# EasyEDA Pro project ProPrj_觉之瞳 ESP32_2025-01-02.epro

# Schematic Schematic1
Board Name: Board1; Create Date: 2024-11-07; Page Name: P1; Project Name: 觉之瞳 ESP32; Schematic Name: Schematic1; Update Date: 2024-12-07; Company: 嘉立创EDA; Page Size: A4; Version: V1.0
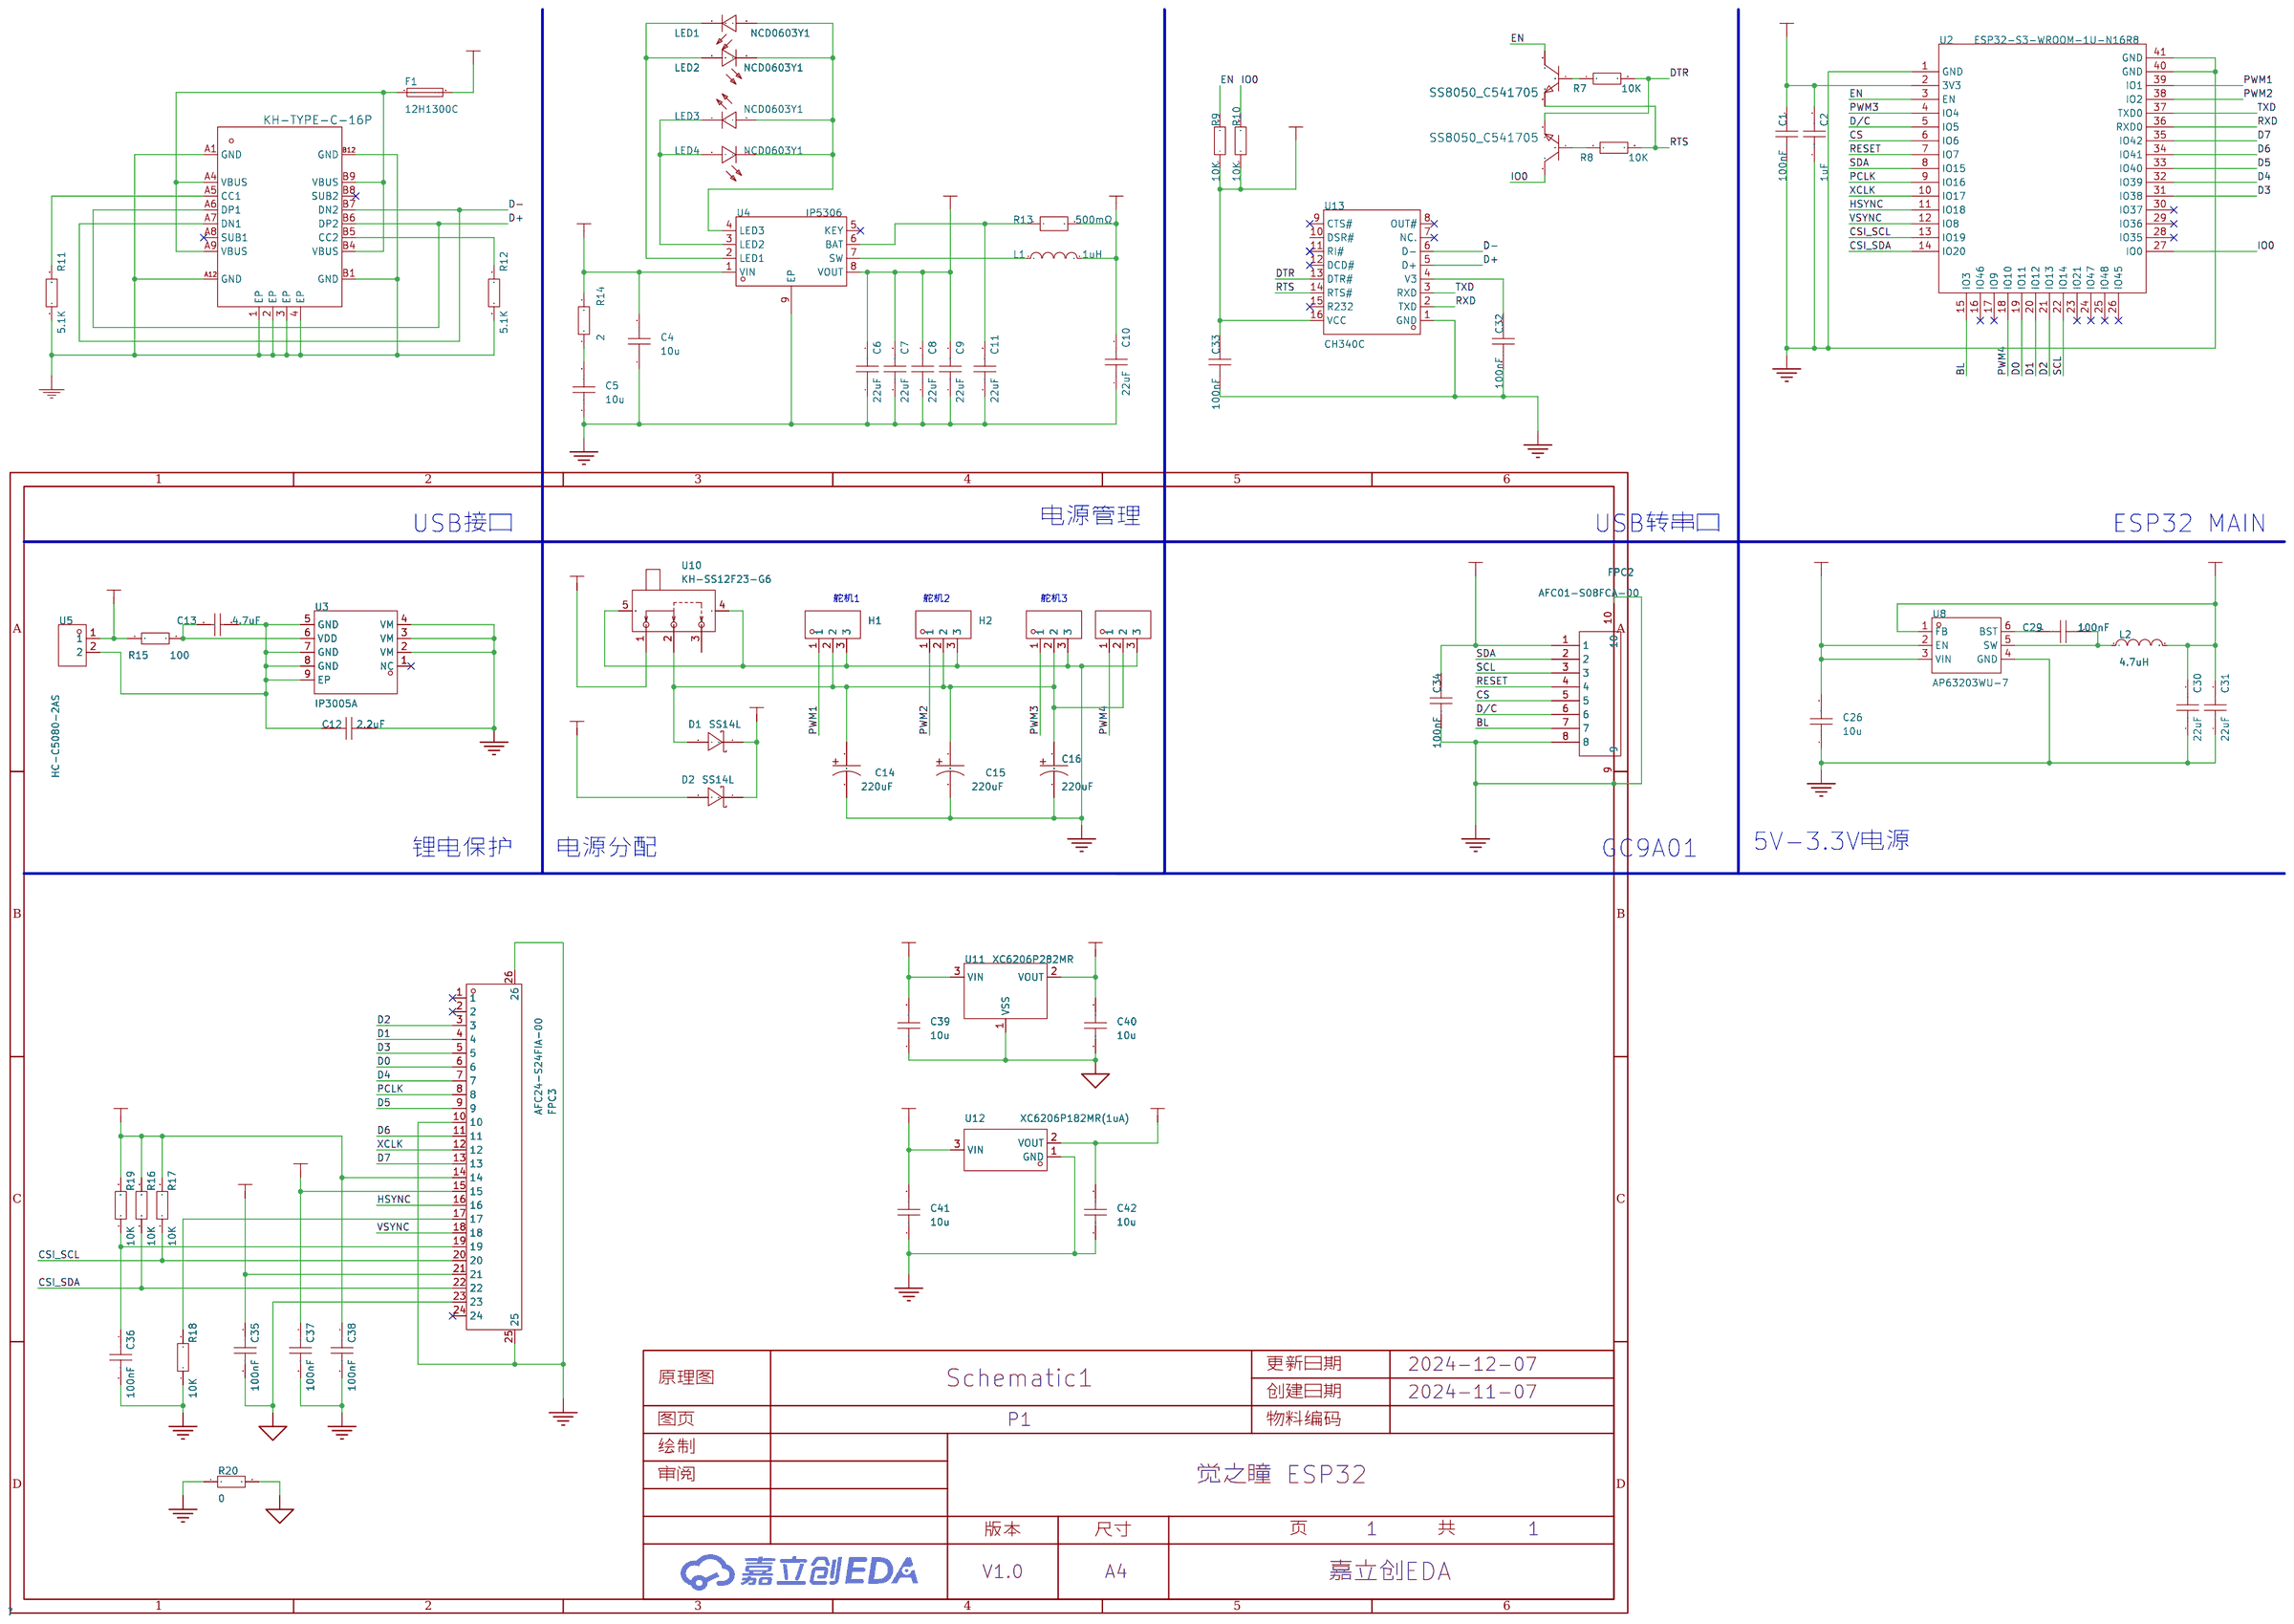
[diagram p0: schematic sheet]

## Parts
C1  100nF  [C0603]
C2  1uF  [C0603]
C4  10u  [C0603]
C5  10u  [C0603]
C6  22uF  [C0805]
C7  22uF  [C0805]
C8  22uF  [C0805]
C9  22uF  [C0805]
C10  22uF  [C0805]
C11  22uF  [C0805]
C12  2.2uF  [C0603]
C13  4.7uF  [C0603]
C14  220uF  [CAP-SMD_BD6.3-L6.6-W6.6-FD-A]
C15  220uF  [CAP-SMD_BD6.3-L6.6-W6.6-FD-A]
C16  220uF  [CAP-SMD_BD6.3-L6.6-W6.6-FD-A]
C26  10u  [C0603]
C29  100nF  [C0603]
C30  22uF  [C0805]
C31  22uF  [C0805]
C32  100nF  [C0603]
C33  100nF  [C0603]
C34  100nF  [C0603]
C35  100nF  [C0603]
C36  100nF  [C0603]
C37  100nF  [C0603]
C38  100nF  [C0603]
C39  10u  [C0603]
C40  10u  [C0603]
C41  10u  [C0603]
C42  10u  [C0603]
D1  SS14L  [SOD-123F_L2.8-W1.8-LS3.7-RD]
D2  SS14L  [SOD-123F_L2.8-W1.8-LS3.7-RD]
F1  12H1300C  [F1206]
FPC2  AFC01-S08FCA-00  [FPC-SMD_P0.50-8P_FGS-XJ-H2.0]
FPC3  AFC24-S24FIA-00  [FPC-SMD_P0.50-24P_QCHF-SM-H2.0]
H1  -  [HDR-TH_3P-P2.54-V-M]
H2  -  [HDR-TH_3P-P2.54-V-M]
H3  -  [HDR-TH_3P-P2.54-V-M]
H4  -  [HDR-TH_3P-P2.54-V-M]
L1  1uH  [IND-SMD_L7.0-W6.6]
L2  4.7uH  [IND-SMD_L4.4-W4.2]
LED1  NCD0603Y1  [LED0603-RD]
LED2  NCD0603Y1  [LED0603-RD]
LED3  NCD0603Y1  [LED0603-RD]
LED4  NCD0603Y1  [LED0603-RD]
Q1  SS8050_C541705  [SOT-23-3_L2.9-W1.3-P1.90-LS2.4-BR]
Q2  SS8050_C541705  [SOT-23-3_L2.9-W1.3-P1.90-LS2.4-BR]
R7  10K  [R0603]
R8  10K  [R0603]
R9  10K  [R0603]
R10  10K  [R0603]
R11  5.1K  [R0603]
R12  5.1K  [R0603]
R13  500mΩ  [R0805]
R14  2  [R0603]
R15  100  [R0603]
R16  10K  [R0603]
R17  10K  [R0603]
R18  10K  [R0603]
R19  10K  [R0603]
R20  0  [R0603]
U2  ESP32-S3-WROOM-1U-N16R8  [WIRELM-SMD_ESP32-S3-WROOM-1U]
U3  IP3005A  [ESOP-8_L4.9-W3.9-P1.27-LS6.0-BL-EP]
U4  IP5306  [ESOP-8_L4.9-W3.9-P1.27-LS6.0-BL-EP]
U5  HC-C5080-2AS  [CONN-TH_HC-C5080-2AS]
U8  AP63203WU-7  [TSOT-26_L2.9-W1.6-P0.95-LS2.8-BL]
U10  KH-SS12F23-G6  [SW-TH_KH-SS12F23-G6]
U11  XC6206P282MR  [SOT-23-3_L2.9-W1.3-P0.95-LS2.4-BR]
U12  XC6206P182MR(1uA)  [SOT-23-3_L2.9-W1.6-P1.90-LS2.8-BR]
U13  CH340C  [SOP-16_L10.0-W3.9-P1.27-LS6.0-BL]
USB1  KH-TYPE-C-16P  [USB-C-SMD_KH-TYPE-C-16P]

## Library data of the parts
C1 C29 C32-C38 = CL10B104KB8NNNC: 容值:100nF;精度:±10%;额定电压:50V;材质(温度系数):X7R;; LCSC Part Name: 100nF ±10% 50V; Supplier Part: C1591; Manufacturer: SAMSUNG(三星); Supplier Footprint: 0603; JLCPCB Part Class: 扩展库; Datasheet: https://atta.szlcsc.com/upload/public/pdf/source/20160218/1457707763339.pdf; Supplier: LCSC; Tolerance: ±10%; Voltage Rated: 50V; Temperature Coefficient: X7R
C2 = CL10A105KB8NNNC: 容值:1uF;精度:±10%;额定电压:50V;材质(温度系数):X5R;; LCSC Part Name: 1uF ±10% 50V; Supplier Part: C15849; Manufacturer: SAMSUNG(三星); Supplier Footprint: 0603; JLCPCB Part Class: 基础库; Datasheet: https://atta.szlcsc.com/upload/public/pdf/source/20160218/1457707763339.pdf; Supplier: LCSC; Tolerance: ±10%; Voltage Rated: 50V; Temperature Coefficient: X5R
C4 C5 C26 C39-C42 = CAP_0603: Supplier Footprint: 0603
C6-C11 C30 C31 = CL21A226MAQNNNE: 容值:22uF;精度:±20%;额定电压:25V;材质(温度系数):X5R;; LCSC Part Name: 22uF ±20% 25V; Supplier Part: C45783; Manufacturer: SAMSUNG(三星); Supplier Footprint: 0805; JLCPCB Part Class: 基础库; Datasheet: https://atta.szlcsc.com/upload/public/pdf/source/20160218/1457707763339.pdf; Supplier: LCSC; Tolerance: ±20%; Voltage Rated: 25V; Temperature Coefficient: X5R
C12 = CL10A225KB8NNNC: 容值:2.2uF;精度:±10%;额定电压:50V;材质(温度系数):X5R;; LCSC Part Name: 2.2uF ±10% 50V; Supplier Part: C913904; Manufacturer: SAMSUNG(三星); Supplier Footprint: 0603; JLCPCB Part Class: 扩展库; Datasheet: https://atta.szlcsc.com/upload/public/pdf/source/20160218/1457707763339.pdf; Supplier: LCSC; Tolerance: ±10%; Voltage Rated: 50V; Temperature Coefficient: X5R
C13 = CL10A475KO8NNNC: 容值:4.7uF;精度:±10%;额定电压:16V;材质(温度系数):X5R;; LCSC Part Name: 4.7uF ±10% 16V; Supplier Part: C19666; Manufacturer: SAMSUNG(三星); Supplier Footprint: 0603; JLCPCB Part Class: 基础库; Datasheet: https://atta.szlcsc.com/upload/public/pdf/source/20160218/1457707763339.pdf; Supplier: LCSC; Tolerance: ±10%; Voltage Rated: 16V; Temperature Coefficient: X5R
C14-C16 = OVZ221M0JTR-0606: 容值:220uF;精度:±20%;额定电压:6.3V;纹波电流:3.16A@100kHz;等效串联电阻:15mΩ@100kHz~300kHz;类型:-;; LCSC Part Name: 220uF ±20% 6.3V; Supplier Part: C182403; Manufacturer: lelon(立隆); Supplier Footprint: SMD,D6.3xL5.9mm; JLCPCB Part Class: 扩展库; Datasheet: https://atta.szlcsc.com/upload/public/pdf/source/20180224/C182403_15194369721561364002.pdf; Supplier: LCSC; Tolerance: ±20%; Rated Voltage: 6.3V; Ripple Current: 3.16A@100kHz; Equivalent Series Resistance(ESR): 15mΩ@100kHz~300kHz; φD: 6.3mm; L: 5.9mm; Lifetime @ Temp: 2000hrs@105℃; Operating Temperature: -55℃~+105℃
D1 D2 = SS14L: 正向压降(Vf):550mV@1A;直流反向耐压(Vr):40V;平均整流电流(Io):1A;; LCSC Part Name: 电压:40V 电流:1A; Supplier Part: C190475; Manufacturer: Hottech(合科泰); Supplier Footprint: SOD-123FL; JLCPCB Part Class: 扩展库; Datasheet: https://atta.szlcsc.com/upload/public/pdf/source/20220428/72E7AB72DDDD17C14C2A3F6F251D8FA3.pdf; Supplier: LCSC; Forward Voltage (Vf@If): 550mV@1A; Reverse Voltage (Vr): 40V; Average Rectified Current (Io): 1A
F1 = 12H1300C: 类型:贴片式保险丝;额定电流:3A;额定电压 (DC):63V;分断能力:50A;; LCSC Part Name: 贴片式保险丝; Supplier Part: C182445; Manufacturer: LANSON(良胜); Supplier Footprint: 1206; JLCPCB Part Class: 扩展库; Datasheet: https://atta.szlcsc.com/upload/public/pdf/source/20180301/C182975_15198945731771384144.pdf; Supplier: LCSC; Type: 贴片式保险丝; Current Rating: 3A; Voltage Rating (DC): 63V; Operating Temperature: -55℃~+125℃; Breaking Capacity: 50A
FPC2 = AFC01-S08FCA-00: 锁定特性:翻盖式;触点类型:下接;触点数量:8P;间距:0.5mm;安装类型:卧贴;; LCSC Part Name: 间距:0.5mm P数:8P 翻盖式 下接; Supplier Part: C262657; Manufacturer: JS(钜硕电子); Supplier Footprint: SMD,P=0.5mm,卧贴; JLCPCB Part Class: 扩展库; Datasheet: https://atta.szlcsc.com/upload/public/pdf/source/20190816/C413942_2A72D1AC756EAE17EEDF756A339D4500.pdf; Supplier: LCSC; Locking Feature: 翻盖式; Contact Type: 下接; Number of Contacts: 8P; Pitch: 0.5mm; Mounting Type: 卧贴; FFC, FCB Thickness: 0.3mm; Height Above Board: 2mm
FPC3 = AFC24-S24FIA-00: 锁定特性:翻盖式;触点类型:双侧触点/上下接;触点数量:24P;间距:0.5mm;安装类型:卧贴;; LCSC Part Name: 间距:0.5mm P数:24P 翻盖式 双侧触点/上下接; Supplier Part: C262683; Manufacturer: JS(钜硕电子); Supplier Footprint: SMD,P=0.5mm,卧贴; JLCPCB Part Class: 扩展库; Datasheet: https://atta.szlcsc.com/upload/public/pdf/source/20180814/C262679_7FB2CAD07E71B2E22E52A118EE33337B.pdf; Supplier: LCSC; Locking Feature: 翻盖式; Contact Type: 双侧触点/上下接; Number of Contacts: 24P; Pitch: 0.5mm; Mounting Type: 卧贴; FFC, FCB Thickness: 0.3mm; Height Above Board: 2mm
H1-H4 = HDR-M_2.54_1x3P: Supplier Part: C2937625; Supplier Footprint: 插件; JLCPCB Part Class: 扩展库
L1 = FXL0630-1R0-M: 电感值:1uH;精度:±20%;额定电流:12A;饱和电流(Isat):15A;类型:一体成型电感;; LCSC Part Name: 1uH ±20% 15A; Supplier Part: C167216; Manufacturer: cjiang(长江微电); Supplier Footprint: SMD,6.6x7mm; JLCPCB Part Class: 扩展库; Datasheet: https://atta.szlcsc.com/upload/public/pdf/source/20240426/3189EA8206330E2108542F9E34E540E7.pdf; Supplier: LCSC; Tolerance: ±20%; Rated Current: 12A; Saturation Current (Isat): 15A; DC Resistance (DCR): 7.4mΩ; Type: 一体成型电感
L2 = FXL0420-4R7-M: 电感值:4.7uH;精度:±20%;额定电流:2.8A;饱和电流(Isat):3A;类型:一体成型电感;; LCSC Part Name: 4.7uH ±20% 3A; Supplier Part: C167208; Manufacturer: cjiang(长江微电); Supplier Footprint: SMD,4.2x4.4mm; JLCPCB Part Class: 扩展库; Datasheet: https://atta.szlcsc.com/upload/public/pdf/source/20240426/3189EA8206330E2108542F9E34E540E7.pdf; Supplier: LCSC; Tolerance: ±20%; Rated Current: 2.8A; Saturation Current (Isat): 3A; DC Resistance (DCR): 105mΩ; Type: 一体成型电感
LED1-LED4 = NCD0603Y1: 发光颜色:黄色;正向电压(VF):1.6V~2.6V;功率:65mW;正向电流:20mA;主波长:586nm~595nm;透镜颜色:无色透明透镜;发光强度:80mcd~220mcd;发光角度:130°;工作温度:-30℃~+85℃;; Supplier Part: C84268; Manufacturer: 国星光电; Supplier Footprint: 0603; JLCPCB Part Class: 扩展库; Datasheet: https://atta.szlcsc.com/upload/public/pdf/source/20200820/C84268_8FC106CB292CF978F9CFC6892464F83C.pdf; Supplier: LCSC; Emitted Color: 黄色; Forward Voltage (VF): 1.6V~2.6V; Power Dissipation: 65mW; Forward Current: 20mA; Dominant Wavelength: 586nm~595nm; Lens Color: 无色透明透镜; Luminous Intensity: 80mcd~220mcd; Viewing Angle: 130°; Operating Temperature: -30℃~+85℃
Q1 = SS8050_C541705_SOT-23-3_L2.9-W1.3-P1.90-LS2.4-BR: Supplier: LCSC; Supplier Part: C541705; Manufacturer: AnBon; Manufacturer Part: SS8050; JLCPCB Part Class: Extended Part
Q2 = SS8050_C541705: Supplier: LCSC; Supplier Part: C541705; Manufacturer: AnBon; Manufacturer Part: SS8050; JLCPCB Part Class: Extended Part
R7-R12 R14-R20 = Res_0603: Supplier Footprint: 0603
R13 = FRL0805JR500TS: 电阻类型:厚膜电阻;阻值:500mΩ;精度:±5%;功率:125mW;最大工作电压:300V;温度系数:±300ppm/℃;; LCSC Part Name: 500mΩ ±5% 125mW 厚膜电阻; Supplier Part: C2934281; Manufacturer: FOJAN(富捷); Supplier Footprint: 0805; JLCPCB Part Class: 扩展库; Datasheet: https://atta.szlcsc.com/upload/public/pdf/source/20211221/925EC7D7225764EE0046F22065062C87.pdf; Supplier: LCSC; Type: 厚膜电阻; Tolerance: ±5%; Power(Watts): 125mW; Overload Voltage (Max): 300V; Temperature Coefficient: ±300ppm/℃; Operating Temperature Range: -55℃~+155℃
U2 = ESP32-S3-WROOM-1U-N16R8: Supplier Part: C3013946; Manufacturer: ESPRESSIF(乐鑫); Supplier Footprint: SMD,18x19.2mm; JLCPCB Part Class: 扩展库; Datasheet: https://atta.szlcsc.com/upload/public/pdf/source/20240130/9D71F4DF55874C504AB629FEEE3F038E.pdf; Supplier: LCSC
U3 = IP3005A: 过充电压:4.28V,过充恢复电压:4.1V,高精度内置MOSFET单节锂电池保护IC; Supplier Part: C181685; Manufacturer: INJOINIC(英集芯); Supplier Footprint: ESOP-8; JLCPCB Part Class: 扩展库; Datasheet: https://atta.szlcsc.com/upload/public/pdf/source/20181019/C181685_8FCD62B90ABBC24A3EFF28CA6DF89AAB.pdf; Supplier: LCSC
U4 = IP5306: 2.1A充电2.4A放电高集成度移动电源SOC; Supplier Part: C181692; Manufacturer: INJOINIC(英集芯); Supplier Footprint: ESOP-8; JLCPCB Part Class: 扩展库; Datasheet: https://atta.szlcsc.com/upload/public/pdf/source/20190627/C384572_9925B3DDC4041BC6108E5AB46A2A0AB1.pdf; Supplier: LCSC
U5 = HC-C5080-2AS: 5.08大4pin 插针胶壳：1x2 排数：1 每排PIN数：2 直针; Supplier Part: C5221225; Manufacturer: HCTL(华灿天禄); Supplier Footprint: 插件,P=5.08mm; JLCPCB Part Class: 扩展库; Datasheet: https://atta.szlcsc.com/upload/public/pdf/source/20221108/E6A53B7D2A9884FE981C2CC976040F2D.pdf; Supplier: LCSC
U8 = AP63203WU-7: 功能类型:降压型;输出类型:固定;输入电压:3.8V~32V;输出电压:3.3V;输出电流:2A;; LCSC Part Name: 3.8V至32V输入、2A低静态电流同步降压转换器，增强EMI抑制; Supplier Part: C780769; Manufacturer: DIODES(美台); Supplier Footprint: TSOT-23-6; JLCPCB Part Class: 扩展库; Datasheet: https://atta.szlcsc.com/upload/public/pdf/source/20210622/C780769_099C67289BD3EC61AAFB52D8B07125B3.pdf; Supplier: LCSC; Function: 降压型; Output Type: 固定; Input Voltage: 3.8V~32V; Output Voltage: 3.3V; Output Current: 2A; Switching Frequency: 1.1MHz; Operating Temperature: -40℃~+85℃@(TA); Synchronous Rectification: 是; Number of Outputs: 1; Topology: 降压式; Switch tube (built-in/external): 内置
U10 = KH-SS12F23-G6: LCSC Part Name: 拨动开关 KH-SS12F23-G6; Supplier Part: C5274466; Manufacturer: kinghelm(金航标); Supplier Footprint: 插件; JLCPCB Part Class: 扩展库; Datasheet: https://atta.szlcsc.com/upload/public/pdf/source/20221118/BFF37B84B5CB1A55659AB56BFB65BEAA.pdf; Supplier: LCSC
U11 = XC6206P282MR_C5148690: 输出类型:固定;最大输入电压:8V;输出电压:2.8V;最大输出电流:300mA;输出极性:正极;; LCSC Part Name: 输入8V 输出2.8V 300mA; Supplier Part: C5148690; Manufacturer: HXY MOSFET(华轩阳电子); Supplier Footprint: SOT-23; JLCPCB Part Class: 扩展库; Datasheet: https://atta.szlcsc.com/upload/public/pdf/source/20230315/F404BD4D78A59DDC4661E6A12EB24193.pdf; Supplier: LCSC; Output Type: 固定; Maximum Input Voltage: 8V; Output Voltage: 2.8V; MAX Output Current: 300mA; Dropout Voltage: 240mV@(50mA); Output Polarity: 正极; Number of Outputs: 1
U12 = XC6206P182MR(1uA): 输出类型:-;; Supplier Part: C2827651; Manufacturer: TECH PUBLIC(台舟); Supplier Footprint: SOT-23-3L; JLCPCB Part Class: 扩展库; Datasheet: https://atta.szlcsc.com/upload/public/pdf/source/20210427/C2827651_CB3194A7C09679308DE708B038C8109A.pdf; Supplier: LCSC
U13 = CH340C: 应用功能:收发器;接口协议:USB 2.0;数据速率:2Mbps;; LCSC Part Name: CH340C USB转串口芯片 CH340; Supplier Part: C84681; Manufacturer: WCH(南京沁恒); Supplier Footprint: SOP-16; JLCPCB Part Class: 扩展库; Datasheet: https://atta.szlcsc.com/upload/public/pdf/source/20240619/63986D8440D4E5267A77ACD891CC4DE3.pdf; Supplier: LCSC; Applications Function: 收发器; Protocol: USB 2.0; Supply Voltage: 3.3V；5V; Data Rate: 2Mbps
USB1 = KH-TYPE-C-16P: Supplier: LCSC; Supplier Part: C709357; Manufacturer: Shenzhen Kinghelm Elec; JLCPCB Part Class: Extended Part

## Nets
AGND: C35.2 C39.1 C40.1 FPC3.23 R20.2 U11.1(VSS)
GND: C1.1 C2.1 C4.1 C5.1 C6.1 C7.1 C8.1 C9.1 C10.1 C11.1 C12.1 C14.2 C15.2 C16.2 C26.1 C30.1 C31.1 C32.1 C33.1 C34.1 C36.2 C37.2 C38.2 C41.1 C42.1 FPC2.8 FPC2.9 FPC2.10 FPC3.10 FPC3.25 FPC3.26 H1.3 H2.3 H3.3 H4.3 R11.1 R12.1 R18.1 R20.1 U2.1(GND) U2.40(GND) U2.41(GND) U3.2(VM) U3.3(VM) U3.4(VM) U4.9(EP) U8.4(GND) U10.4 U10.5 U12.1(GND) U13.1(GND) USB1.1(EP) USB1.2(EP) USB1.3(EP) USB1.4(EP) USB1.A1(GND) USB1.A12(GND) USB1.B1(GND) USB1.B12(GND)
BL: FPC2.7 U2.15(IO3)
CS: FPC2.5 U2.6(IO6)
CSI_SCL: FPC3.20 R17.1 U2.13(IO19)
CSI_SDA: FPC3.22 R16.1 U2.14(IO20)
D0: FPC3.6 U2.19(IO11)
D1: FPC3.4 U2.20(IO12)
D2: FPC3.3 U2.21(IO13)
D3: FPC3.5 U2.31(IO38)
D4: FPC3.7 U2.32(IO39)
D5: FPC3.9 U2.33(IO40)
D6: FPC3.11 U2.34(IO41)
D7: FPC3.13 U2.35(IO42)
D+: U13.5(D+) USB1.A6(DP1) USB1.B6(DP2)
D-: U13.6(D-) USB1.A7(DN1) USB1.B7(DN2)
D/C: FPC2.6 U2.5(IO5)
DTR: Q2.2(E) R7.2 U13.13(DTR#)
EN: Q1.3(C) R9.2 U2.3(EN)
HSYNC: FPC3.16 U2.11(IO18)
IO0: Q2.3(C) R10.2 U2.27(IO0)
PCLK: FPC3.8 U2.9(IO16)
PW_5R0V: C6.2 C7.2 C8.2 C9.2 U4.8(VOUT) U10.1
PW_A2R8V: C35.1 C40.2 FPC3.21 U11.2(VOUT)
PW_BAT4R2V: C10.2 L1.2 R13.2 R15.1 U5.1
PW_D1R8V: C37.1 C42.2 FPC3.15 U12.2(VOUT)
PW_D3R3V: C1.2 C2.2 C30.2 C31.2 C33.2 C34.2 C38.1 C39.2 C41.2 FPC2.1 FPC3.14 L2.2 R9.1 R10.1 R16.2 R17.2 R19.2 U2.2(3V3) U8.1(FB) U11.3(VIN) U12.3(VIN) U13.16(VCC)
PW_D5R0V: C26.2 D1.1(K) D2.1(K) U8.2(EN) U8.3(VIN)
PW_USB5V: C4.2 D2.2(A) F1.2 R14.1 U4.1(VIN)
PWM1: H1.1 U2.39(IO1)
PWM2: H2.1 U2.38(IO2)
PWM3: H3.1 U2.4(IO4)
PWM4: H4.1 U2.18(IO10)
RESET: FPC2.4 U2.7(IO7)
RTS: Q1.2(E) R8.2 U13.14(RTS#)
RXD: U2.36(RXD0) U13.2(TXD)
SCL: FPC2.3 U2.22(IO14)
SDA: FPC2.2 U2.8(IO15)
TXD: U2.37(TXD0) U13.3(RXD)
VSYNC: FPC3.18 U2.12(IO8)
XCLK: FPC3.12 U2.10(IO17)
$1N1961: R12.2 USB1.B5(CC2)
$1N1968: F1.1 USB1.A4(VBUS) USB1.A9(VBUS) USB1.B4(VBUS) USB1.B9(VBUS)
$1N1969: R11.2 USB1.A5(CC1)
$1N2610: C5.2 R14.2
$1N2735: L1.1 U4.7(SW)
$1N2746: C11.2 R13.1 U4.6(BAT)
$1N3660: LED1.1(K) LED2.2(A) U4.2(LED1)
$1N3672: LED3.1(K) LED4.2(A) U4.3(LED2)
$1N3684: LED1.2(A) LED2.1(K) LED3.2(A) LED4.1(K) U4.4(LED3)
$1N3817: C12.2 C13.1 U3.5(GND) U3.7(GND) U3.8(GND) U3.9(EP) U5.2
$1N4029: C13.2 R15.2 U3.6(VDD)
$1N4497: C14.1 C15.1 C16.1 D1.2(A) H1.2 H2.2 H3.2 H4.2 U10.2
$1N7889: C29.2 U8.6(BST)
$1N7965: C29.1 L2.1 U8.5(SW)
$1N13558: Q1.1(B) R7.1
$1N13559: Q2.1(B) R8.1
$1N16623: FPC3.17 R18.2
$1N16794: C36.1 FPC3.19 R19.1
$1N29688: C32.2 U13.4(V3)

Not connected (* = marked no-connect by the designer): FPC3 1* 2* 24*; U2 16(IO46)* 17(IO9)* 23(IO21)* 24(IO47)* 25(IO48)* 26(IO45)* 28(IO35)* 29(IO36)* 30(IO37)*; U3 1(NC)*; U4 5(KEY)*; U10 3; U13 7(NC.)* 8(OUT#)* 9(CTS#)* 10(DSR#) 11(RI#)* 12(DCD#)* 15(R232)*; USB1 A8(SUB1)* B8(SUB2)*

## Notes on the sheet
- USB接口
- 电源管理
- USB转串口
- ESP32 MAIN
- 舵机1
- 舵机2
- 舵机3
- 锂电保护
- 电源分配
- GC9A01
- 5V-3.3V电源

# Board PCB1
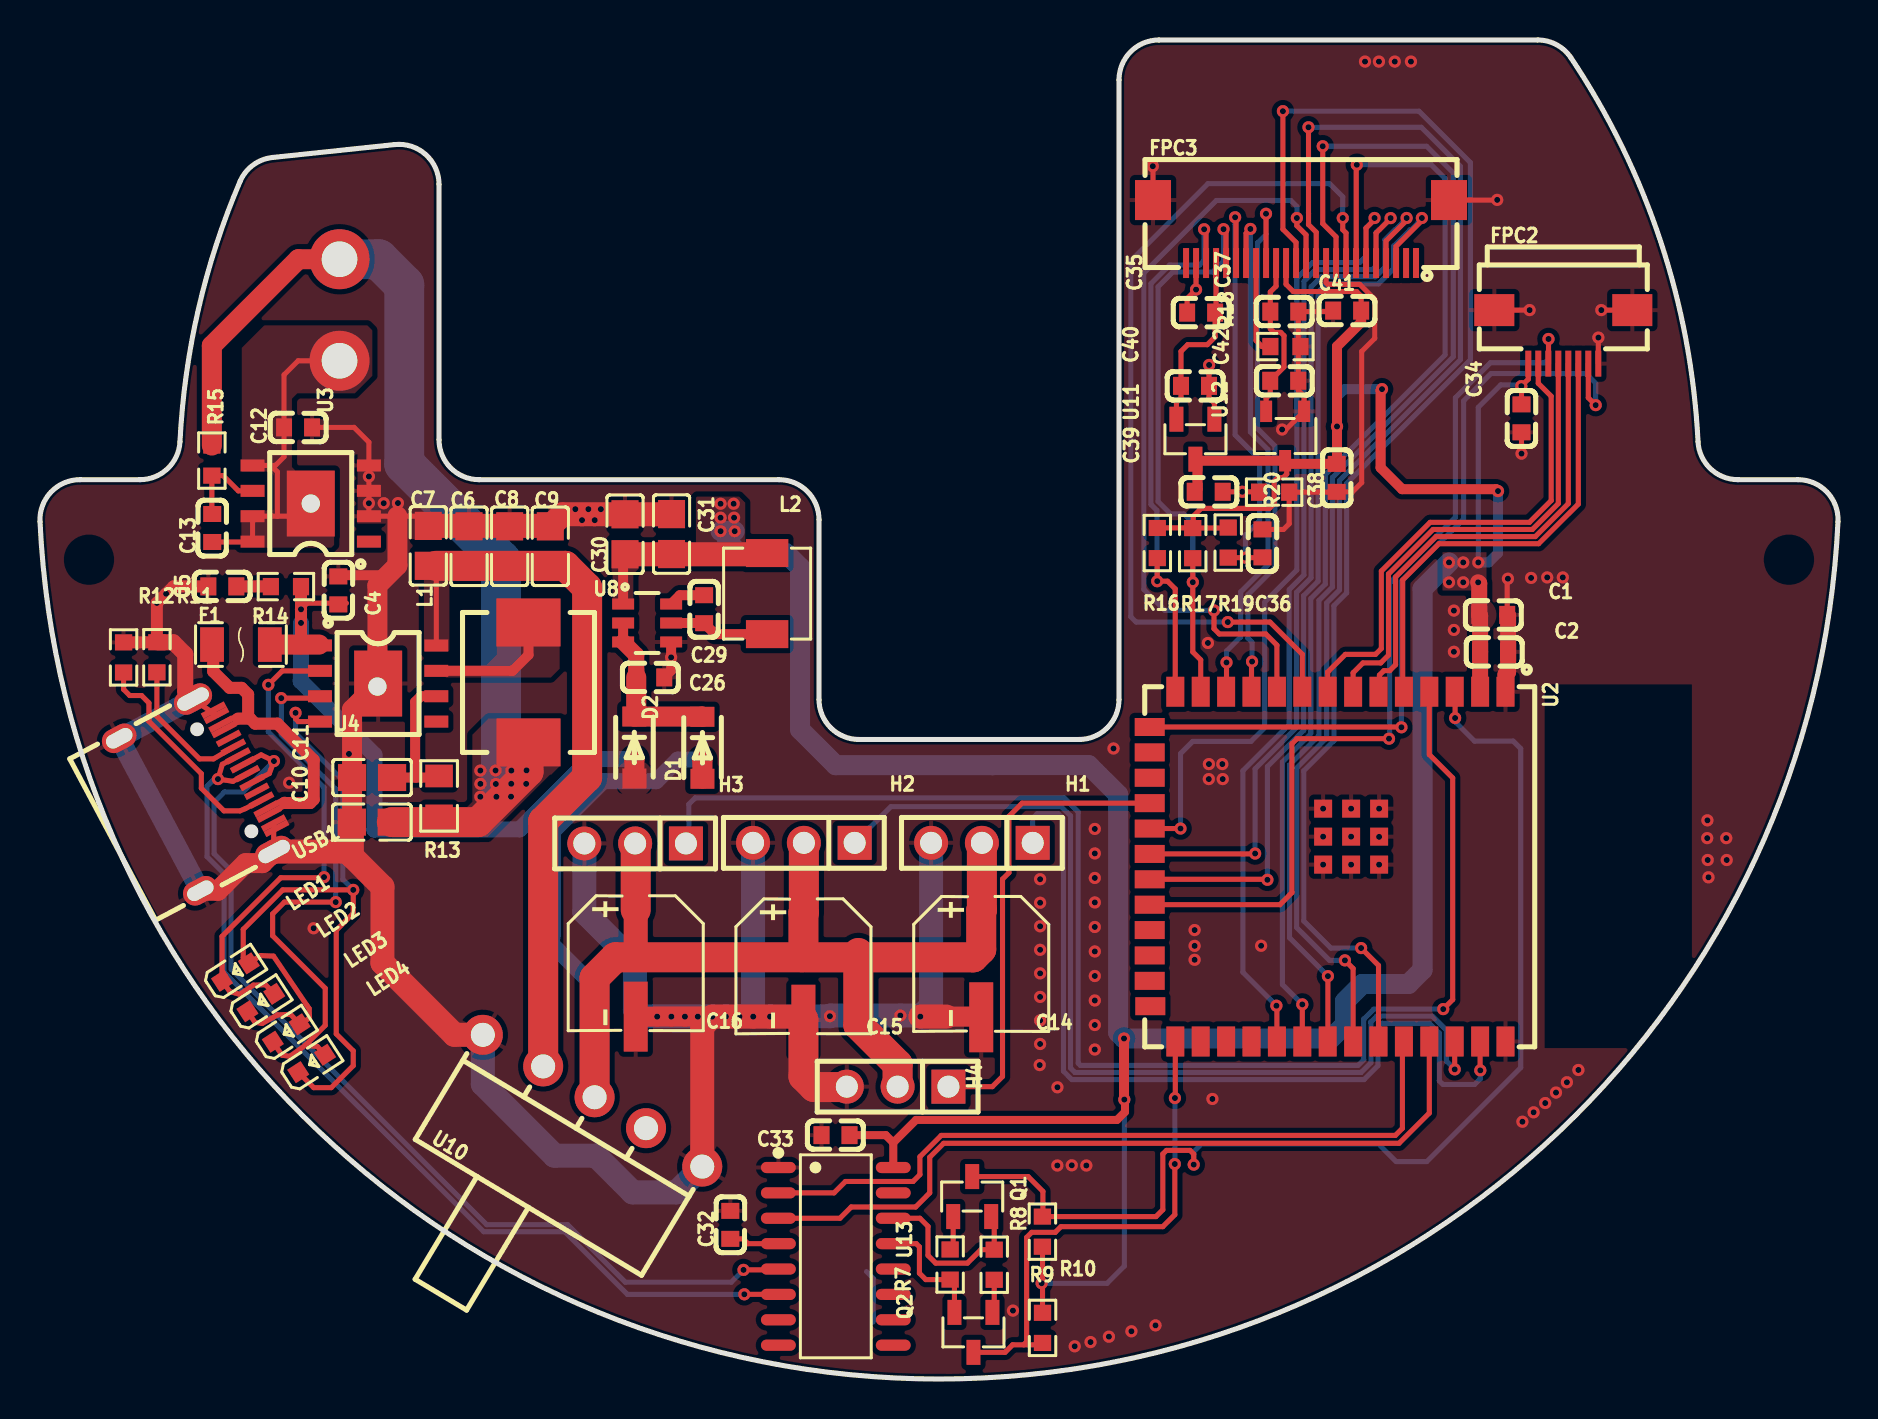
[diagram p1: board, top side]
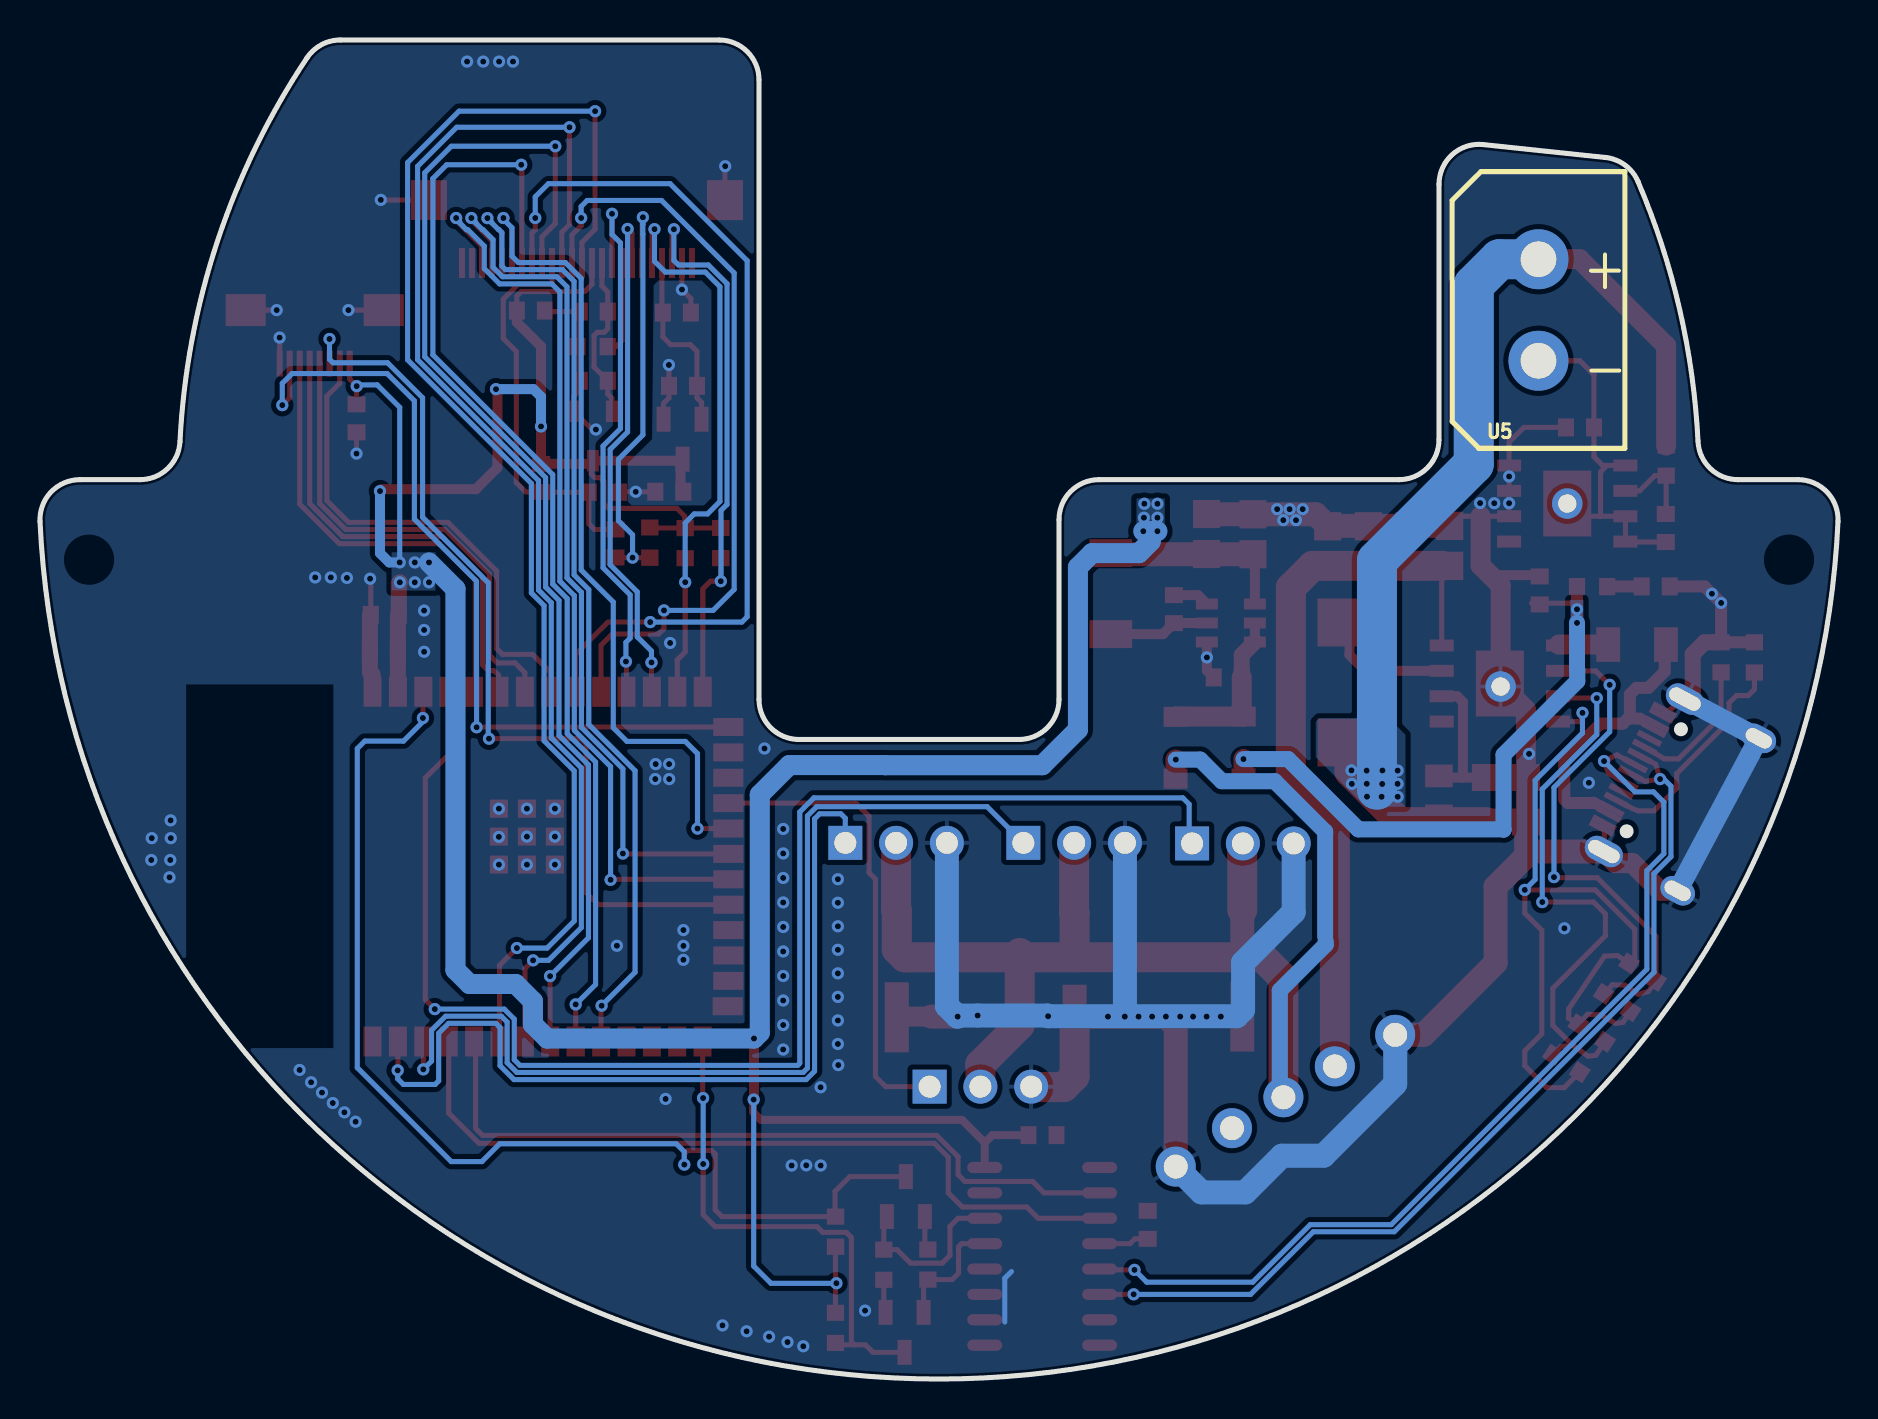
[diagram p2: board, bottom side, seen from below]

Outline 89.9 x 67 mm; copper layers: Top Layer, Bottom Layer. Coordinates in mm from the lower left corner of the outline.
Outline path: 0,42.91 arc(0.55,44.38) 2,45 5,45 arc(6.38,45.55) 7,46.9 arc(7.92,53.54) 10,59.92 arc(10.65,60.74) 11.63,61.12 17.74,61.77 arc(19.29,61.26) 19.95,59.78 19.95,47 arc(20.54,45.59) 21.95,45 36.95,45 arc(38.37,44.41) 38.95,43 38.95,34 arc(39.54,32.59) 40.95,32 51.95,32 arc(53.37,32.59) 53.95,34 53.95,65 arc(54.54,66.41) 55.95,67 74.88,67 arc(75.83,66.76) 76.55,66.11 arc(81.03,56.94) 82.9,46.9 arc(83.52,45.55) 84.9,45 87.9,45 arc(89.35,44.38) 89.9,42.91 arc(44.95,0) 0,42.91
Stack: Top Layer 0.035mm / Dielectric1 1.51mm FR4 er 4.5 / Bottom Layer 0.035mm

## Design rules (mm)
template: JLCPCB Capability(Two Layers Board)
spacing copperThickness1oz (default): track to track 0.102, other pairs 0.152 to 0.3
spacing copperThickness2oz: track to track 0.203, other pairs 0.152 to 0.3
track width copperThickness1oz (default): min 0.127, default 0.254, max 2.54
track width copperThickness2oz: min 0.203, default 0.254, max 2.54
differential pair differentialPair (default): width min 0.127, default 0.254, max 2.54; gap min 0.152, default 0.152
via viaSize (default): diameter min 0.5, default 0.61, max 10; hole min 0.3, default 0.305, max 6.3

## Placement (name value [footprint] x y rotation side)
C1  100nF  [C0603]  72.66 38.23 180 top
C2  1uF  [C0603]  72.71 36.38 180 top
C4  10u  [C0603]  14.92 39.46 270 top
C5  10u  [C0603]  9.12 39.66 0 top
C6  22uF  [C0805]  21.45 41.67 270 top
C7  22uF  [C0805]  19.41 41.69 270 top
C8  22uF  [C0805]  23.48 41.67 270 top
C9  22uF  [C0805]  25.52 41.67 270 top
C10  22uF  [C0805]  16.59 27.87 0 top
C11  22uF  [C0805]  16.6 30.1 0 top
C12  2.2uF  [C0603]  12.9 47.61 180 top
C13  4.7uF  [C0603]  8.61 42.58 90 top
C14  220uF  [CAP-SMD_BD6.3-L6.6-W6.6-FD-A]  47.06 20.77 270 top
C15  220uF  [CAP-SMD_BD6.3-L6.6-W6.6-FD-A]  38.17 20.65 270 top
C16  220uF  [CAP-SMD_BD6.3-L6.6-W6.6-FD-A]  29.79 20.8 270 top
C26  10u  [C0603]  30.51 35.11 180 top
C29  100nF  [C0603]  33.21 38.52 90 top
C30  22uF  [C0805]  29.25 42.27 270 top
C31  22uF  [C0805]  31.58 42.28 270 top
C32  100nF  [C0603]  34.52 7.71 270 top
C33  100nF  [C0603]  39.78 12.2 0 top
C34  100nF  [C0603]  74.08 48.07 90 top
C35  100nF  [C0603]  58.06 53.36 180 top
C36  100nF  [C0603]  61.13 41.81 90 top
C37  100nF  [C0603]  62.22 53.41 0 top
C38  100nF  [C0603]  64.84 45.09 270 top
C39  10u  [C0603]  58.44 44.39 180 top
C40  10u  [C0603]  57.75 49.69 180 top
C41  10u  [C0603]  65.36 53.46 0 top
C42  10u  [C0603]  62.21 49.95 180 top
D1  SS14L  [SOD-123F_L2.8-W1.8-LS3.7-RD]  33.12 31.58 270 top
D2  SS14L  [SOD-123F_L2.8-W1.8-LS3.7-RD]  29.72 31.6 270 top
F1  12H1300C  [F1206]  10.05 36.75 0 top
FPC2  AFC01-S08FCA-00  [FPC-SMD_P0.50-8P_FGS-XJ-H2.0]  76.17 52.14 0 top
FPC3  AFC24-S24FIA-00  [FPC-SMD_P0.50-24P_QCHF-SM-H2.0]  63.05 57.41 0 top
H1  -  [HDR-TH_3P-P2.54-V-M]  47.1 26.83 180 top
H2  -  [HDR-TH_3P-P2.54-V-M]  38.19 26.83 180 top
H3  -  [HDR-TH_3P-P2.54-V-M]  29.76 26.8 180 top
H4  -  [HDR-TH_3P-P2.54-V-M]  42.88 14.63 180 top
L1  1uH  [IND-SMD_L7.0-W6.6]  24.43 34.85 270 top
L2  4.7uH  [IND-SMD_L4.4-W4.2]  36.36 39.3 270 top
LED1  NCD0603Y1  [LED0603-RD]  9.77 20.36 33 top
LED2  NCD0603Y1  [LED0603-RD]  11.04 18.84 33 top
LED3  NCD0603Y1  [LED0603-RD]  12.31 17.31 33 top
LED4  NCD0603Y1  [LED0603-RD]  13.58 15.79 33 top
NOREF  -  [Pad_e764]  16.87 34.65 0 top
NOREF#2  -  [Pad_e765]  13.54 43.8 0 top
Q1  SS8050_C541705  [SOT-23-3_L2.9-W1.3-P1.90-LS2.4-BR]  46.61 9.13 270 top
Q2  SS8050_C541705  [SOT-23-3_L2.9-W1.3-P1.90-LS2.4-BR]  46.67 2.33 90 top
R7  10K  [R0603]  45.51 5.73 270 top
R8  10K  [R0603]  47.71 5.72 90 top
R9  10K  [R0603]  50.12 7.37 90 top
R10  10K  [R0603]  50.13 2.56 270 top
R11  5.1K  [R0603]  5.84 36.11 270 top
R12  5.1K  [R0603]  4.18 36.1 270 top
R13  500mΩ  [R0805]  19.95 29.18 270 top
R14  2  [R0603]  12.3 39.65 180 top
R15  100  [R0603]  8.59 45.95 270 top
R16  10K  [R0603]  55.87 41.83 90 top
R17  10K  [R0603]  57.64 41.82 90 top
R18  10K  [R0603]  62.27 51.66 180 top
R19  10K  [R0603]  59.41 41.85 90 top
R20  0  [R0603]  61.71 44.37 180 top
U2  ESP32-S3-WROOM-1U-N16R8  [WIRELM-SMD_ESP32-S3-WROOM-1U]  64.38 25.64 270 top
U3  IP3005A  [ESOP-8_L4.9-W3.9-P1.27-LS6.0-BL-EP]  13.54 43.8 90 top
U4  IP5306  [ESOP-8_L4.9-W3.9-P1.27-LS6.0-BL-EP]  16.91 34.8 270 top
U5  HC-C5080-2AS  [CONN-TH_HC-C5080-2AS]  14.98 53.49 270 bottom
U8  AP63203WU-7  [TSOT-26_L2.9-W1.6-P0.95-LS2.8-BL]  30.36 37.83 270 top
U10  KH-SS12F23-G6  [SW-TH_KH-SS12F23-G6]  27.68 14.01 329 top
U11  XC6206P282MR  [SOT-23-3_L2.9-W1.3-P0.95-LS2.4-BR]  57.77 47.02 90 top
U12  XC6206P182MR(1uA)  [SOT-23-3_L2.9-W1.6-P1.90-LS2.8-BR]  62.26 47.18 90 top
U13  CH340C  [SOP-16_L10.0-W3.9-P1.27-LS6.0-BL]  39.79 6.14 270 top
USB1  KH-TYPE-C-16P  [USB-C-SMD_KH-TYPE-C-16P]  8.12 29.38 298 top

## Footprints (pads in the part's own frame, mm; a bottom-side part is the same pattern mirrored in y, then rotated)
C0603
  rect 0.8x0.9 smd: 1(-0.7,0) 2(0.7,0)
C0805
  rect 1.41x1.35 smd: 1(-1,0) 2(1,0)
CAP-SMD_BD6.3-L6.6-W6.6-FD-A
  rect 3.5x1.2 smd: 1(-2.67,0) 2(2.67,0)
CONN-TH_HC-C5080-2AS
  round 3 hole 1.78: 1(-2.54,0) 2(2.54,0)
ESOP-8_L4.9-W3.9-P1.27-LS6.0-BL-EP
  rect 0.6x1.2 smd: 1(-1.905,-2.909) 2(-0.635,-2.909) 3(0.635,-2.909) 4(1.905,-2.909) 5(1.905,2.909) 6(0.635,2.909) 7(-0.635,2.909) 8(-1.905,2.909)
  rect 3.3x2.4 smd: 9(0,0)
F1206
  rect 1.19x1.728 smd: 1(-1.445,0) 2(1.445,0)
FPC-SMD_P0.50-8P_FGS-XJ-H2.0
  rect 0.3x1.3 smd: 1(-1.75,-1.34) 2(-1.252,-1.339) 3(-0.75,-1.34) 4(-0.25,-1.34) 5(0.25,-1.34) 6(0.75,-1.34) 7(1.25,-1.34) 8(1.75,-1.34)
  rect 2x1.6 smd: 9(3.45,1.34) 10(-3.45,1.34)
FPC-SMD_P0.50-24P_QCHF-SM-H2.0
  rect 0.3x1.5 smd: 1(5.75,-1.574) 2(5.252,-1.575) 3(4.752,-1.575) 4(4.252,-1.575) 5(3.752,-1.575) 6(3.252,-1.575) 7(2.752,-1.575) 8(2.252,-1.575) 9(1.752,-1.575) 10(1.252,-1.575) 11(0.752,-1.575) 12(0.252,-1.575) 13(-0.248,-1.575) 14(-0.748,-1.575) 15(-1.248,-1.575) 16(-1.748,-1.575) 17(-2.248,-1.575) 18(-2.748,-1.575) 19(-3.248,-1.575) 20(-3.748,-1.575) 21(-4.248,-1.575) 22(-4.748,-1.575) 23(-5.248,-1.575) 24(-5.748,-1.575)
  rect 1.8x2 smd: 25(7.4,1.575) 26(-7.4,1.575)
HDR-TH_3P-P2.54-V-M
  rect 1.7x1.7 hole 1.1: 1(-2.54,0)
  round 1.7 hole 1.1: 2(0,0) 3(2.54,0)
IND-SMD_L4.4-W4.2
  rect 1.4x2.12 smd: 1(2.028,0) 2(-2.028,0)
IND-SMD_L7.0-W6.6
  rect 2.4x3.2 smd: 1(-3,0) 2(3,0)
LED0603-RD
  rect 0.8x0.8 smd: 1(-0.799,0) 2(0.799,0)
Pad_e764
  round 1.524 hole 0.914: 1(0,0)
Pad_e765
  round 1.524 hole 0.914: 2(0,0)
R0603
  rect 0.806x0.864 smd: 1(-0.753,0) 2(0.753,0)
R0805
  rect 1.133x1.377 smd: 1(-1,0) 2(1,0)
SOD-123F_L2.8-W1.8-LS3.7-RD
  rect 1x1.2 smd: 1(-1.55,0) 2(1.55,0)
SOP-16_L10.0-W3.9-P1.27-LS6.0-BL
  oval 0.56x1.745 smd: 1(-4.445,-2.873) 2(-3.175,-2.873) 3(-1.905,-2.873) 4(-0.635,-2.873) 5(0.635,-2.873) 6(1.905,-2.873) 7(3.175,-2.873) 8(4.445,-2.873) 9(4.445,2.873) 10(3.175,2.873) 11(1.905,2.873) 12(0.635,2.873) 13(-0.635,2.873) 14(-1.905,2.873) 15(-3.175,2.873) 16(-4.445,2.873)
SOT-23-3_L2.9-W1.3-P0.95-LS2.4-BR
  rect 1.25x0.7 smd: 1(1,-0.95) 2(1,0.95) 3(-1,0)
SOT-23-3_L2.9-W1.3-P1.90-LS2.4-BR
  rect 1.25x0.7 smd: 1(1,-0.95) 2(1,0.95) 3(-1,0)
SOT-23-3_L2.9-W1.6-P1.90-LS2.8-BR
  rect 1.07x0.6 smd: 1(1.235,-0.95) 2(1.235,0.95) 3(-1.235,0)
SW-TH_KH-SS12F23-G6
  round 2 hole 1.2: 1(-3,0.1) 2(0,0.1) 3(3,0.1) 4(6.4,-0.1) 5(-6.4,-0.1)
TSOT-26_L2.9-W1.6-P0.95-LS2.8-BL
  rect 0.55x1.1 smd: 1(-0.95,-1.2) 2(0,-1.2) 3(0.95,-1.2) 4(0.95,1.2) 5(0,1.2) 6(-0.95,1.2)
USB-C-SMD_KH-TYPE-C-16P
  oval 1.2x2 hole 0.7x1.7: 1(-4.32,1.765) 2(4.32,1.765)
  oval 1.2x1.8 hole 0.7x1.4: 3(-4.32,-2.415) 4(4.32,-2.415)
  rect 0.3x1.3 smd: A1(-3.35,2.416) A4(-2.55,2.416) A5(-1.25,2.416) A6(-0.25,2.416) A7(0.25,2.416) A8(1.25,2.415) A9(2.55,2.415) A12(3.35,2.416) B1(3.05,2.416) B4(2.25,2.415) B5(1.75,2.416) B6(0.75,2.416) B7(-0.75,2.416) B8(-1.75,2.415) B9(-2.25,2.416) B12(-3.05,2.416)
WIRELM-SMD_ESP32-S3-WROOM-1U
  rect 1.5x0.9 smd: 1(-8.75,8.895) 2(-8.75,7.625) 3(-8.75,6.355) 4(-8.75,5.085) 5(-8.75,3.815) 6(-8.75,2.545) 7(-8.75,1.275) 8(-8.75,0.005) 9(-8.75,-1.265) 10(-8.75,-2.535) 11(-8.75,-3.805) 12(-8.75,-5.075) 13(-8.75,-6.345) 14(-8.75,-7.615) 27(8.75,-7.615) 28(8.75,-6.345) 29(8.75,-5.075) 30(8.75,-3.805) 31(8.75,-2.535) 32(8.75,-1.265) 33(8.75,0.005) 34(8.75,1.275) 35(8.75,2.545) 36(8.75,3.815) 37(8.75,5.085) 38(8.75,6.355) 39(8.75,7.625) 40(8.75,8.895)
  rect 0.9x1.5 smd: 15(-6.985,-8.895) 16(-5.715,-8.895) 17(-4.445,-8.895) 18(-3.175,-8.895) 19(-1.905,-8.895) 20(-0.635,-8.895) 21(0.635,-8.895) 22(1.905,-8.895) 23(3.175,-8.895) 24(4.445,-8.895) 25(5.715,-8.895) 26(6.985,-8.865)
  rect 0.9x0.9 smd: 41(-2.9,2.575) 41(-2.9,1.175) 41(-2.9,-0.225) 41(-1.5,2.575) 41(-1.5,1.175) 41(-1.5,-0.225) 41(-0.1,2.575) 41(-0.1,1.175) 41(-0.1,-0.225)

## Nets
As in the schematic, except:
GND: C1.1 C2.1 C4.1 C5.1 C6.1 C7.1 C8.1 C9.1 C10.1 C11.1 C12.1 C14.2 C15.2 C16.2 C26.1 C30.1 C31.1 C32.1 C33.1 C34.1 C36.2 C37.2 C38.2 C41.1 C42.1 FPC2.8 FPC2.9 FPC2.10 FPC3.10 FPC3.25 FPC3.26 H1.3 H2.3 H3.3 H4.3 NOREF.1 R11.1 R12.1 R18.1 R20.1 U2.1 U2.40 U2.41 U3.2 U3.3 U3.4 U4.9 U8.4 U10.4 U10.5 U12.1 U13.1 USB1.1 USB1.2 USB1.3 USB1.4 USB1.A1 USB1.A12 USB1.B1 USB1.B12
$1N3817: C12.2 C13.1 NOREF#2.2 U3.5 U3.7 U3.8 U3.9 U5.2

Pads without a net: FPC3 1 2 24; U2 16 17 23 24 25 26 28 29 30; U3 1; U4 5; U10 3; U13 7 8 9 10 11 12 15; USB1 A8 B8

## Via types
v1: diameter 0.61, hole 0.305, Top Layer to Bottom Layer, 194 vias

## Routing (per net, layer and track width the routed paths; a pad name or vN(x,y) marks a point on that pad's centre or on a via; arc(x,y) is an arc through that point)
AGND: length 7.3
  Top Layer w0.254: U11.1 58.72,48.82 58.45,49.09 C40.1 58.45,50.73 v1(58.46,50.74) ; C35.2 57.36,54.06 v1(57.8,54.51) FPC3.23 ; R20.2 60.93,44.39 v1(60.12,44.39) C39.1
GND: length 219.4
  Top Layer w0.254: C41.1 64.61,53.41 C37.2 62.92,49.46 63.21,49.17 U12.1 62.3,47.51 v1(62.11,47.51) ; USB1.2 11.69,26.42 11.69,27.82 ; FPC2.8 77.92,52.1 v1(77.92,52.11) ; FPC3.25 72.85,58.99 v1(72.86,59) ; FPC3.10 64.3,54.86 64.4,54.77 65.99,54.77 66.74,54.02 66.74,52.07 66.09,51.42 66.09,44.85 65.62,44.39 C38.2 64.82,44.37 R20.1 62.46,42.79 62.18,42.51 61.92,42.51 61.92,42.51 C36.2 ; v1(73.4,40.04) 73.36,40.01 C1.1 ; FPC2.9 v1(78.07,53.48) ; 7.65,34.02 8.82,33.21 ; C34.1 v1(74.08,46.3) ; C7.1 18.93,43.17 16.45,43.17 v1(16.45,43.82) v1(16.45,45.16) 16.45,46.87 15.7,47.61 C12.1 ; FPC2.10 v1(74.48,53.48) ; v1(55.64,60.68) 55.65,60.67 55.65,58.99
  Top Layer w0.5: 15.32,40.22 16.89,40.22 ; C26.1 31.56,35.45 v1(31.56,36.11) U8.4
  Top Layer w0.6: R12.1 R11.1 v1(5.84,38.83) v1(6.31,39.29) 6.67,39.66 C5.1
  Top Layer w0.8: C1.1 73.41,38.19 C2.1 73.41,35.38 73.28,35.25 U2.1 ; R11.1 6.67,36.87 7.26,36.27 7.26,34.41 7.65,34.02
  Top Layer w1: C16.2 v1(30.86,18.13) v1(31.57,18.13) v1(32.25,18.13) v1(32.89,18.13) v1(33.61,18.13) ; C14.2 47.03,18.13 45.33,18.13 ; 16.87,34.76 15.6,33.5 C11.1 15.6,27.88 C10.1 ; 16.87,34.76 16.87,39.71 17.87,40.71 17.87,43.17 ; 16.87,34.76 U4.9 ; USB1.4 8.9,24.43 10.28,25.81 11.13,25.81 USB1.2
  Top Layer w1.2: U10.4 33.11,17.64 v1(33.61,18.13) v1(34.3,18.13) v1(34.97,18.13) v1(35.66,18.13) v1(36.5,18.13) 38.17,18.13 ; 15.59,26.16 15.36,26.39 USB1.2 ; 15.59,26.16 C10.1 ; 15.59,26.16 17.12,24.63 17.12,20.82 20.72,17.22 U10.5 ; C7.1 25.49,42.69 C9.1 26.12,43.27 C30.1 31.57,43.27 C31.1 ; v1(44.02,18.13) 45.33,18.13
  Top Layer w1.5: H4.3 40.32,14.61 38.71,14.61 38.17,15.14 C15.2
  Bottom Layer w0.254: 41.33,5.38 41.66,5.04 41.66,2.85
  Bottom Layer w1: USB1.4 USB1.3 7.65,34.02
  Bottom Layer w1.2: H3.3 27.22,23.36 29.75,20.83 29.75,18.48 30.07,18.15 v1(39.5,18.15) 39.53,18.19 v1(43.02,18.19) 43.96,18.19 v1(44.02,18.13) 44.56,18.67 H1.3 ; 35.65,26.83 35.65,18.6 35.65,18.59 ; U10.4 31.82,9.34 29.64,9.34 27.8,11.17 25.73,11.17 22.14,14.76 U10.5
  vias: v1(12.46,29.83) v1(13.68,22.55) v1(15.45,31.28) v1(17.19,43.82) v1(17.9,43.83) v1(26.77,43.52) v1(27.1,42.97) v1(27.42,43.52) v1(27.74,42.97) v1(28.04,43.52) v1(48.65,3.42) v1(50.01,25.01) v1(50.01,23.83) v1(50.01,22.65) v1(50.01,21.48) v1(50.01,20.3) v1(50.01,19.12) v1(50.01,17.94) v1(50.01,16.76) v1(49.99,15.71) v1(50.87,14.6) v1(50.87,10.68) v1(51.59,10.69) v1(51.74,1.64) v1(52.32,10.68) v1(52.53,1.85) v1(52.74,27.52) v1(52.74,26.3) v1(52.74,25.07) v1(52.74,23.84) v1(52.74,22.62) v1(52.74,21.39) v1(52.74,20.17) v1(52.74,18.94) v1(52.74,17.71) v1(52.74,16.49) v1(53.45,2.12) v1(53.68,31.55) v1(54.57,2.39) v1(55.78,2.68) v1(57.73,22.46) v1(57.73,21.67) v1(57.73,20.98) v1(58.4,36.83) v1(58.44,30.02) v1(58.45,30.77) v1(58.62,14.01) v1(59.12,30.77) v1(59.14,30.02) v1(61.06,21.68) v1(64.16,28.54) v1(64.16,27.14) v1(64.16,25.74) v1(65.56,28.54) v1(65.56,27.14) v1(65.56,25.74) v1(66.25,65.92) v1(66.95,65.92) v1(66.96,28.54) v1(66.96,27.13) v1(66.96,25.74) v1(67.74,65.92) v1(68.55,65.92) v1(70.7,38.45) v1(70.7,37.48) v1(70.7,36.39) v1(74.12,12.87) v1(74.56,40.08) v1(74.68,13.34) v1(75.26,13.81) v1(75.36,40.11) v1(75.8,14.33) v1(76.14,40.11) v1(76.35,14.85) v1(76.92,15.46) v1(83.37,27.95) v1(83.36,27.06) v1(83.39,25.97) v1(83.43,25.1) v1(84.31,27.06) v1(84.34,25.97)
BL: length 40.9
  Top Layer w0.254: U2.15 68.06,32.62 v1(68.07,32.61) ; v1(77.79,48.73) 77.42,49.1 FPC2.7
  Bottom Layer w0.254: v1(77.79,48.73) 77.79,49.82 77.3,50.31 72.55,50.31 71.18,48.94 71.18,43.03 68.07,39.92 v1(68.07,32.61)
CS: length 23.4
  Top Layer w0.254: FPC2.5 76.42,43.8 74.77,42.15 69.8,42.15 67.78,40.13 67.78,35.74 67.49,35.44 67.2,35.44 66.97,35.22 66.97,34.43 U2.6
CSI_SCL: length 29.9
  Top Layer w0.254: U2.13 58.04,35.98 57.64,36.38 v1(57.64,39.87) 57.64,41.07 R17.1 ; FPC3.20 59.3,57.41 v1(59.18,57.53)
  Bottom Layer w0.254: v1(57.64,39.87) 57.64,42.83 57.19,43.29 56.53,43.29 55.91,43.91 55.91,54.66 56.63,55.39 58.63,55.39 59.18,55.93 v1(59.18,57.53) 59.17,57.54
CSI_SDA: length 28.8
  Top Layer w0.254: v1(58.21,57.53) 58.3,57.43 FPC3.22 ; R16.1 55.86,41.07 v1(55.86,39.92) 56.38,39.92 56.76,39.53 56.76,34.39 U2.14
  Bottom Layer w0.254: v1(58.21,57.53) 58.21,55.97 57.97,55.74 56.49,55.74 55.55,54.8 55.55,43.76 55.85,43.46 55.85,39.93 v1(55.86,39.92)
D0: length 41.5
  Top Layer w0.254: U2.19 v1(57.03,27.54) ; FPC3.6 66.3,57.59 66.73,58.01
  Bottom Layer w0.254: v1(57.03,27.54) 57.03,31.29 57.64,31.9 60.55,31.9 61.24,32.59 61.24,38.87 62.84,40.48 62.84,55.07 63.63,55.87 65.99,55.87 66.3,56.18 66.3,57.6 66.73,58.03 v1(66.73,58.09)
D1: length 44.4
  Top Layer w0.254: v1(60.76,26.29) 60.74,26.27 U2.20 ; FPC3.4 67.3,56.95 68.33,57.97 68.33,58.04
  Bottom Layer w0.254: v1(68.33,58.09) 68.12,57.87 68.12,57.85 67.77,57.5 67.74,57.5 67.25,57.01 67.25,55.63 66.78,55.15 64.06,55.15 63.55,54.65 63.55,40.09 62.83,39.36 62.83,32.6 60.76,30.53 v1(60.76,26.29)
D2: length 46.4
  Top Layer w0.254: FPC3.3 67.8,56.67 69.09,57.96 ; U2.21 61.35,25 v1(61.37,24.98)
  Bottom Layer w0.254: v1(61.37,24.98) 61.37,30.64 63.18,32.46 63.18,39.2 63.91,39.92 63.91,54.39 64.31,54.8 66.92,54.8 67.69,55.56 67.69,56.68 68.51,57.51 68.57,57.51 68.92,57.85 68.92,57.91 v1(69.09,58.09)
D3: length 49.2
  Top Layer w0.254: U2.31 61.85,18.65 v1(61.82,18.68) ; v1(67.53,58.09) 67.53,58.07 66.8,57.34 FPC3.5
  Bottom Layer w0.254: v1(61.82,18.68) 60.15,20.35 60.15,30.43 62.46,32.75 62.46,39.5 63.2,40.23 63.2,54.92 63.78,55.51 66.63,55.51 66.81,55.69 66.81,57.36 66.95,57.51 66.97,57.51 67.31,57.85 67.31,57.87 v1(67.53,58.09)
D4: length 56.6
  Top Layer w0.254: v1(63.12,18.74) U2.32 ; v1(65.84,60.76) 65.81,60.73 65.81,55.85 FPC3.7
  Bottom Layer w0.254: v1(65.84,60.76) 69.56,60.76 70.26,60.06 70.26,51.24 64.27,45.25 64.27,39.77 63.54,39.05 63.54,32.29 62.12,30.87 62.12,19.74 v1(63.12,18.74)
D5: length 60.9
  Top Layer w0.254: v1(64.14,61.68) 64.14,57.81 64.8,57.15 FPC3.9 ; v1(64.4,20.16) 64.4,16.9 U2.33
  Bottom Layer w0.254: v1(64.14,61.68) 69.33,61.68 70.67,60.35 70.67,51.15 64.62,45.1 64.62,39.63 63.95,38.96 63.95,32.2 62.48,30.73 62.48,22.08 v1(64.4,20.16)
D6: length 64.2
  Top Layer w0.254: U2.34 65.66,20.54 v1(65.25,20.95) ; v1(63.43,62.63) 63.43,58.34 63.43,58.33 63.43,57.85 63.43,57.85 63.43,57.76 63.81,57.38 63.81,55.85 63.8,55.84 FPC3.11
  Bottom Layer w0.254: v1(65.25,20.95) 64.47,20.95 62.83,22.59 62.83,30.58 64.34,32.08 64.34,38.84 64.98,39.48 64.98,44.96 71.02,51 71.02,60.68 69.07,62.63 v1(63.43,62.63)
D7: length 68.2
  Top Layer w0.254: v1(66.06,21.56) 66.93,20.69 U2.35 ; v1(62.15,63.44) 62.15,57.53 62.8,56.87 FPC3.13
  Bottom Layer w0.254: v1(66.06,21.56) 64.55,21.56 63.19,22.92 63.19,30.43 64.7,31.94 64.7,38.7 65.33,39.33 65.33,44.81 71.52,51 71.52,60.86 68.95,63.44 v1(62.15,63.44)
D+: length 50.1
  Top Layer w0.254: U13.5 36.88,5.46 v1(35.18,5.46) ; USB1.B6 11.47,30.3 v1(11.7,30.92) 11.06,31.23 USB1.A6
  Bottom Layer w0.254: v1(35.18,5.46) 34.56,4.85 29.26,4.85 26.38,7.72 22.33,7.72 9.56,20.5 9.56,25.43 8.71,26.28 8.71,28.86 9.22,29.38 10.16,29.38 v1(11.7,30.92)
D-: length 48
  Top Layer w0.254: v1(35.22,4.24) 36.91,4.24 U13.6 ; USB1.B7 9.12,30.76 v1(8.9,30.02) 9.65,29.91 10.37,30.29
  Bottom Layer w0.254: v1(8.9,30.02) 8.71,30.02 8.35,29.66 8.35,26.13 9.2,25.28 9.2,20.35 22.19,7.37 26.24,7.37 29.37,4.23 35.21,4.23 v1(35.22,4.24)
D/C: length 23
  Top Layer w0.254: U2.5 68.14,34.45 68.14,39.98 69.95,41.8 74.93,41.8 76.92,43.78 FPC2.6
DTR: length 6.1
  Top Layer w0.254: U13.13 43.81,6.77 43.97,6.61 43.97,5.29 44.29,4.98 R7.2 45.72,4.76 Q2.2
EN: length 57
  Top Layer w0.254: v1(70.76,33.07) 70.76,34.37 U2.3 ; 50.15,8.15 50.15,9.39 49.41,10.13 Q1.3 ; v1(57.69,10.73) 57.69,11.26 57.51,11.44 56.32,11.44 56.14,11.26 56.14,8.47 55.8,8.13 R9.2
  Bottom Layer w0.254: v1(70.76,33.07) 70.76,32.89 71.73,31.92 73.66,31.92 74.04,31.54 74.04,15.58 69.34,10.88 67.81,10.88 66.92,11.77 58.08,11.77 57.69,11.37 v1(57.69,10.73)
HSYNC: length 27.6
  Top Layer w0.254: v1(60.6,35.9) 60.58,35.87 U2.11 ; FPC3.16 61.3,58.3 v1(61.3,58.3)
  Bottom Layer w0.254: v1(61.3,58.3) 61.3,57.27 60.88,56.85 60.88,47.55 61.75,46.68 61.75,40.59 60.39,39.24 60.39,37.07 60.6,36.86 v1(60.6,35.9)
IO0: length 25.6
  Top Layer w0.254: 49.18,1.71 50.04,1.71 R10.2 ; 49.18,1.71 48.63,1.71 48.25,1.33 Q2.3 ; 49.18,1.71 49.33,1.86 49.33,7.08 49.59,7.34 50.76,7.34 51.05,7.62 56.14,7.62 56.74,8.22 v1(56.74,10.76) ; v1(56.75,14.06) 56.77,14.08 U2.27
  Bottom Layer w0.254: v1(56.74,10.76) 56.74,14.05 v1(56.75,14.06)
PCLK: length 44.9
  Top Layer w0.254: v1(59.39,37.87) 61.5,37.87 63.12,36.26 U2.9 ; v1(65.14,58.09) 65.14,57.51 65.3,57.34 FPC3.8
  Bottom Layer w0.254: v1(65.14,58.09) 65.14,59.15 64.48,59.81 58.4,59.81 54.54,55.95 54.54,38.14 54.81,37.87 v1(59.39,37.87)
PW_5R0V: length 37.3
  Top Layer w0.254: 19.79,40.69 19.82,40.66 U4.8
  Top Layer w1: 19.79,40.69 C7.2
  Top Layer w1.5: U10.1 25.16,27.91 27.36,30.11 27.36,39.59 26.26,40.69 19.79,40.69
PW_A2R8V: length 9.2
  Top Layer w0.254: FPC3.21 58.8,53.41 C35.1 58.76,52.14 58.37,51.75 57.39,51.75 57.05,51.42 C40.2 57.05,49.09 56.82,48.86 U11.2
PW_BAT4R2V: length 53.5
  Top Layer w1: U5.1 12.92,56.03 8.59,51.7 R15.1
  Top Layer w1.5: L1.2 24.43,30.39 21.9,27.87 C10.2
  Bottom Layer w2: 23.05,29.49 23.05,40.95 18.21,45.79 18.21,54.74 16.93,56.03 U5.1
  vias: v1(22.02,30.44) v1(22.02,29.78) v1(22.02,29.13) v1(22.78,30.45) v1(22.79,29.77) v1(22.82,29.13) v1(23.57,30.44) v1(23.56,29.78) v1(23.55,29.14) v1(24.33,30.45) v1(24.31,29.78)
PW_D1R8V: length 8.4
  Top Layer w0.254: FPC3.15 61.8,54.68 61.52,54.39 C37.1 61.52,52.55 61.7,52.37 62.04,52.37 62.2,52.21 62.2,50.64 C42.2 61.51,49.28 61.31,49.07 U12.2
PW_D3R3V: length 197.8
  Top Layer w0.254: 57.66,42.58 57.66,43.16 58.06,43.56 61.47,43.56 61.71,43.8 61.71,44.92 61.9,45.11 61.91,45.1 62.16,45.1 62.34,45.28 62.34,45.87 ; 57.66,42.58 57.66,42.59 55.97,42.59 ; 57.66,42.58 59.39,42.58 R19.2 ; R9.1 50.13,6.62 R10.1 ; U11.3 57.77,44.43 ; FPC2.1 74.42,50.03 v1(74.07,49.68) 74.08,49.67 C34.2 ; C41.2 66.06,54.19 65.83,54.41 62.67,54.41 62.3,54.78 FPC3.14
  Top Layer w0.4: 54.25,13.95 54.25,13.36 53.85,12.96 43.8,12.96 42.66,11.83 ; C33.2 42.29,12.2 42.66,11.83 ; 42.66,11.83 U13.16
  Top Layer w0.5: U8.1 29.16,41.17 C30.2 ; v1(72.9,44.43) 72.81,44.52 68.11,44.52 67.03,45.6 67.03,49.46 v1(67.1,49.53) ; C39.2 57.88,44.53 57.88,45.85 57.97,45.95 U12.3 ; 62.34,45.87 62.42,45.79 C38.1 64.85,45.8 v1(64.85,47.66) 64.85,51.67 66.06,52.88 C41.2 ; v1(54.2,17.04) 54.2,14 v1(54.22,13.98)
  Top Layer w0.8: U2.2 C2.2 72.01,38.19 71.96,38.23 71.96,39.81 v1(71.91,39.86)
  Top Layer w1.2: C30.2 36.3,41.27 L2.2
  Bottom Layer w0.254: v1(54.22,13.98) 54.22,5.65 53.35,4.79 50.09,4.79 v1(50.08,4.79) ; v1(74.07,49.68) 74,49.74 73.04,49.74 71.92,48.62 v1(71.92,40.86)
  Bottom Layer w0.5: v1(71.92,40.86) 72.44,40.86 72.9,41.32 v1(72.9,44.43) ; v1(67.1,49.53) 65.23,49.53 64.85,49.15 v1(64.85,47.66)
  Bottom Layer w1: v1(70.45,40.86) 69.13,39.54 69.13,20.47 68.42,19.76 66.12,19.76 65.25,18.9 65.25,17.75 64.55,17.04 v1(54.2,17.04) 53.91,17.33 53.91,29.24 52.43,30.72 47.65,30.72 47.64,30.71 39.79,30.71 38,32.49 38,40.62 37.3,41.32 34.95,41.32 34.37,41.91 34.37,42.42 ; 34.37,42.42 v1(34.74,42.42) ; 34.37,42.42 v1(34.03,42.42)
  vias: v1(34.03,43.79) v1(34.03,43.1) v1(34.68,43.79) v1(34.7,43.1) v1(70.45,39.86) v1(71.16,40.86) v1(71.16,39.86)
PW_D5R0V: length 8.4
  Top Layer w0.5: U8.2 U8.3
  Top Layer w0.8: C26.2 29.81,36.22 U8.3
  Top Layer w1: D1.1 33.11,33.15 D2.1 29.81,33.24 C26.2
PW_USB5V: length 35.1
  Top Layer w0.254: v1(13.05,38.51) 13.36,38.82 15.32,38.82
  Top Layer w0.6: 13.03,36.75 13.05,36.77 v1(13.05,37.83) v1(13.05,38.51) R14.1
  Top Layer w1: D2.2 29.72,31.01 v1(29.73,31.02) ; 11.49,36.75 13.95,36.75
  Bottom Layer w0.8: v1(29.73,31.02) 27.5,31.02 23.98,27.5 16.74,27.5 16.72,27.49 16.72,31.23 13.04,34.92 13.04,35.49 13.05,35.51 v1(13.05,37.83)
PWM1: length 43.5
  Top Layer w0.254: U2.39 72.01,15.45 v1(72.02,15.44)
  Bottom Layer w0.254: H1.1 49.64,28.06 49.86,28.28 50.92,28.28 51.17,28.03 51.17,15.4 51.59,14.98 66.2,14.98 66.9,15.68 66.9,17.59 67.11,17.8 69.48,17.8 69.97,17.3 69.97,14.92 70.15,14.74 71.73,14.74 72.02,15.02 v1(72.02,15.44)
PWM2: length 49.4
  Top Layer w0.254: U2.38 v1(70.74,15.49)
  Bottom Layer w0.254: H2.1 42.54,28.64 51.07,28.64 51.53,28.18 51.53,15.56 51.75,15.34 66.05,15.34 66.54,15.83 66.54,17.86 66.83,18.15 69.62,18.15 70.32,17.45 70.32,15.91 v1(70.74,15.49)
PWM3: length 71.7
  Top Layer w0.254: v1(70.16,18.51) 70.64,18.98 70.64,30.07 69.47,31.24 U2.4
  Bottom Layer w0.254: v1(70.16,18.51) 66.69,18.51 66.19,18.01 66.19,15.97 65.91,15.69 52.02,15.69 51.91,15.8 51.91,28.37 51.21,29.08 32.76,29.08 32.44,28.76 32.44,26.94 H3.1
PWM4: length 23.4
  Top Layer w0.254: H4.1 47.62,14.63 48.13,15.14 48.13,25.01 48.45,25.33 48.45,28.15 49.11,28.81 U2.18
RESET: length 24.1
  Top Layer w0.254: U2.7 65.66,35.34 66.15,35.83 67.04,35.83 67.43,36.22 67.43,40.28 69.66,42.51 74.62,42.51 75.92,43.81 FPC2.4
RTS: length 8.8
  Top Layer w0.254: Q1.2 47.71,7.98 R8.2 47.05,6.47 46.37,5.8 44.79,5.8 44.4,6.18 44.4,7.64 44,8.04 U13.14
RXD: length 37.4
  Top Layer w0.254: U2.36 68.12,16.81 68.12,12.54 67.77,12.19 45.06,12.19 44,11.12 44,10.23 43.65,9.88 40.27,9.88 39.7,9.31 U13.2
SCL: length 45.9
  Top Layer w0.254: v1(75.43,52.04) 75.43,50.81 FPC2.3 ; v1(67.45,32.04) 62.85,32.04 62.6,31.79 62.6,24.33 62,23.73 U2.22
  Bottom Layer w0.254: v1(75.43,52.04) 75.43,51.02 75.25,50.85 72.52,50.85 70.77,49.1 70.77,43.12 67.49,39.84 67.49,32.08 v1(67.45,32.04)
SDA: length 25.1
  Top Layer w0.254: U2.8 64.39,35.37 65.27,36.26 66.78,36.26 67.07,36.55 67.07,40.43 69.51,42.86 74.47,42.86 75.56,43.95 75.56,49.17 74.91,49.82 FPC2.2
TXD: length 39.4
  Top Layer w0.254: U13.3 40,8.04 40.56,8.61 43.78,8.61 44.49,9.31 44.49,11.1 45.18,11.79 67.95,11.79 69.47,13.31 U2.37
VSYNC: length 26.2
  Top Layer w0.254: v1(59.33,35.85) 59.33,34.41 U2.12 ; FPC3.18 60.3,57.33 v1(60.52,57.54)
  Bottom Layer w0.254: v1(59.33,35.85) 59.33,36.42 60.04,37.13 60.04,39.38 61.39,40.74 61.39,46.51 60.52,47.38 v1(60.52,57.54)
XCLK: length 38.7
  Top Layer w0.254: v1(58.7,38.46) 58.7,37.54 58.97,37.28 61.29,37.28 61.85,36.72 U2.10 ; 62.84,58.01 62.84,57.71 63.3,57.25 FPC3.12
  Bottom Layer w0.254: v1(62.84,58.09) 62.84,58.67 62.54,58.97 58.82,58.97 55.19,55.34 55.19,39.51 56.24,38.46 v1(58.7,38.46)
$1N1961: length 11.4
  Top Layer w0.254: R12.2 4.18,34.51 4.49,34.2 5.08,34.2 5.45,33.83 5.45,32.91 8.07,30.29 8.07,29.56 9.2,28.43 10,28.43 10.27,28.54 USB1.B5
$1N1968: length 17.2
  Top Layer w0.254: USB1.A9 12.26,28.7 12.11,28.96 USB1.B4 ; USB1.B9 9.93,32.89 9.79,33.16 ; 9.79,33.16 9.91,33.05 ; 9.79,33.16 USB1.A4
  Top Layer w0.6: 9.91,33.05 10.51,33.05 ; 10.51,33.05 10.76,32.79 11.87,32.79 13.69,30.97 13.69,29 13.51,28.82 12.25,28.82 12.23,28.83 ; 10.51,33.05 10.41,33.14 10.41,34.25 10.08,34.58 9.48,34.58 8.66,35.4 8.66,36.69 F1.1
$1N1969: length 7.1
  Top Layer w0.254: R11.2 5.84,33.16 7.98,31.03 8.68,31.03 USB1.A5
$1N2610: length 1.7
  Top Layer w0.6: C5.2 11.53,39.66 R14.2
$1N2735: length 6.6
  Top Layer w0.5: U4.7 23.63,35.43 24.43,36.23 L1.1
$1N2746: length 7.4
  Top Layer w0.5: 18.79,30.1 18.76,30.13 18.76,33.88 19.04,34.16 U4.6 ; 18.79,30.1 C11.2 ; 18.79,30.1 19.87,30.1 R13.1
$1N3660: length 25.4
  Top Layer w0.254: v1(11.42,34.73) 12.11,35.43 13.99,35.43 U4.2 ; v1(14.2,25.11) 14.17,25.08 12.04,25.08 9.1,22.15 LED1.1 9.49,19.39 9.99,19.25 10.67,19.71 11.28,19.73 LED2.2
  Bottom Layer w0.254: v1(11.42,34.73) 11.42,32.38 14.2,29.6 v1(14.2,25.11)
$1N3672: length 28.1
  Top Layer w0.254: 13.27,16.7 12.5,16.15 12.11,16.2 LED3.1 ; 13.27,16.7 14.26,17.69 14.26,19.55 11.63,22.18 11.63,23.27 12.22,23.86 v1(14.79,23.86) ; 13.27,16.7 13.87,16.64 LED4.2 ; v1(12.06,34.07) 13.9,34.07 U4.3
  Bottom Layer w0.254: v1(12.06,34.07) 12.06,32.24 14.79,29.52 14.79,23.86
$1N3684: length 41.6
  Top Layer w0.254: v1(12.78,33.33) 12.78,33.04 12.92,32.89 U4.4 ; LED4.1 13.69,14.58 14.56,14.58 15.66,15.68 15.66,16.42 14.81,17.27 14.81,22.45 15.66,23.3 v1(15.66,24.47) 12.14,24.47 10.16,22.5 10.16,21.08 LED1.2 11.03,21.19 11.68,21.16 13.34,18.71 13.46,18.54 13.48,18.06 LED3.2 12.53,18.25 11.88,18.22 11.11,17.79 10.75,17.85 LED2.1
  Bottom Layer w0.254: v1(15.66,24.47) 15.14,24.99 15.14,29.96 12.78,32.32 v1(12.78,33.33)
$1N3817: length 18.1
  Top Layer w0.254: 11.55,45.71 11.77,45.71 12.2,46.15 C12.2 12.2,50.24 12.91,50.95 U5.2 ; 11.55,45.71 11.87,45.39 11.87,43.17 ; 11.55,45.71 U3.5 ; 11.87,43.17 10.63,43.17 U3.8 10.61,41.88 C13.1 ; 11.87,43.17 12.9,43.17 U3.9
$1N4029: length 4.3
  Top Layer w0.254: C13.2 8.59,43.3 8.59,45.2 9.16,45.2 9.92,44.44 U3.6
$1N4497: length 74.1
  Top Layer w1: 29.97,21.1 29.79,21.29 C16.1 ; D1.2 33.12,30.98 v1(33.11,30.99)
  Top Layer w1.5: 40.92,21.1 46.66,21.1 47.06,21.5 C14.1 47.1,23.47 H1.2 ; 40.92,21.1 38.26,21.1 ; 40.92,21.1 40.92,17.71 42.88,15.75 H4.2 ; 40.92,21.1 40.92,21.32 ; H2.2 38.19,23.34 C15.1 38.17,21.19 38.08,21.1 28.77,21.1 27.73,20.07 U10.2 ; C16.1 29.79,26.77 H3.2
  Bottom Layer w0.8: U10.2 27.91,14.28 27.91,19.44 25.62,21.73 25.62,21.91 ; v1(33.11,30.99) 31.89,30.99 30.81,29.91 28.17,29.91 25.64,27.39 25.64,22.16
$1N7889: length 1.8
  Top Layer w0.5: U8.6 32,39.22 C29.2
$1N7965: length 5
  Top Layer w0.5: L2.1 33.75,37.27 C29.1 33.2,37.83 U8.5
$1N13558: length 1.7
  Top Layer w0.254: Q1.1 45.66,6.64 R7.1
$1N13559: length 1.7
  Top Layer w0.254: R8.1 47.71,3.42 Q2.1
$1N16623: length 4.7
  Top Layer w0.254: R18.2 61.11,51.66 60.8,51.96 FPC3.17
$1N16794: length 21.9
  Top Layer w0.254: v1(59.76,58.13) 59.8,58.08 FPC3.19 ; R19.1 v1(60.27,41.1) 61.11,41.1 C36.1
  Bottom Layer w0.254: v1(59.76,58.13) 59.76,57.78 59.76,57.78 59.76,57.29 59.76,57.29 59.76,47.24 60.98,46.01 60.98,42.95 60.27,42.24 v1(60.27,41.1)
$1N29688: length 2.5
  Top Layer w0.254: U13.4 35.4,6.77 35.16,7.01 C32.2

## Copper pours and planes (outline as drawn; the poured copper is in the pictures)
AGND on Bottom Layer: 56.33,54.96 60.52,54.96 60.52,43.71 56.33,43.71
GND on Top Layer: -0.27,67.03 89.98,67.03 89.98,-0.39 -0.27,-0.39
GND on Top Layer: 13.34,48.02 20.15,48.02 20.15,42.02 13.34,42.02
GND on Bottom Layer: -0.73,67.13 90.69,67.13 90.69,-0.65 -0.73,-0.65
PW_5R0V on Top Layer: 19.18,41.29 20.47,41.29 20.47,36.4 19.18,36.4
PW_BAT4R2V on Top Layer: 22.86,33.01 25.98,33.01 25.98,29.76 22.86,29.76
PW_BAT4R2V on Top Layer: 21.15,33.05 25.95,33.05 25.95,27.12 21.15,27.12
PW_BAT4R2V on Bottom Layer: 21.63,33.05 26.11,33.05 26.11,28.64 21.63,28.64
PW_D3R3V on Top Layer: 28.58,41.96 29.93,41.96 29.93,38.52 28.58,38.52
PW_D3R3V on Top Layer: 70.13,41.37 72.33,41.37 72.33,39.45 70.13,39.45
PW_D3R3V on Top Layer: 32.8,44.15 35.26,44.15 35.26,40.69 32.8,40.69
PW_D3R3V on Bottom Layer: 33.66,44.06 35.08,44.06 35.08,42.12 33.66,42.12
PW_D3R3V on Bottom Layer: 70.13,41.37 72.32,41.37 72.32,39.45 70.13,39.45
$1N2735 on Top Layer: 20.13,39 25.99,39 25.99,35.1 20.13,35.1
$1N3817 on Top Layer: 10.07,52.72 16.62,52.72 16.62,41.6 10.07,41.6

Small or netless copper shapes (teardrops, artwork), in the pictures only: 1 on Bottom Layer

## Text on the board
Bottom Silkscreen Layer: - | +
Top Solder Mask Layer: Ver0.0 | 2024.12.02 | Designed by R | 觉之瞳 / ESP32S3
